# EAGLE schematic 60_FN (EAGLE 9.6.2)

## Sheet 1 of 2: Switch Matrix
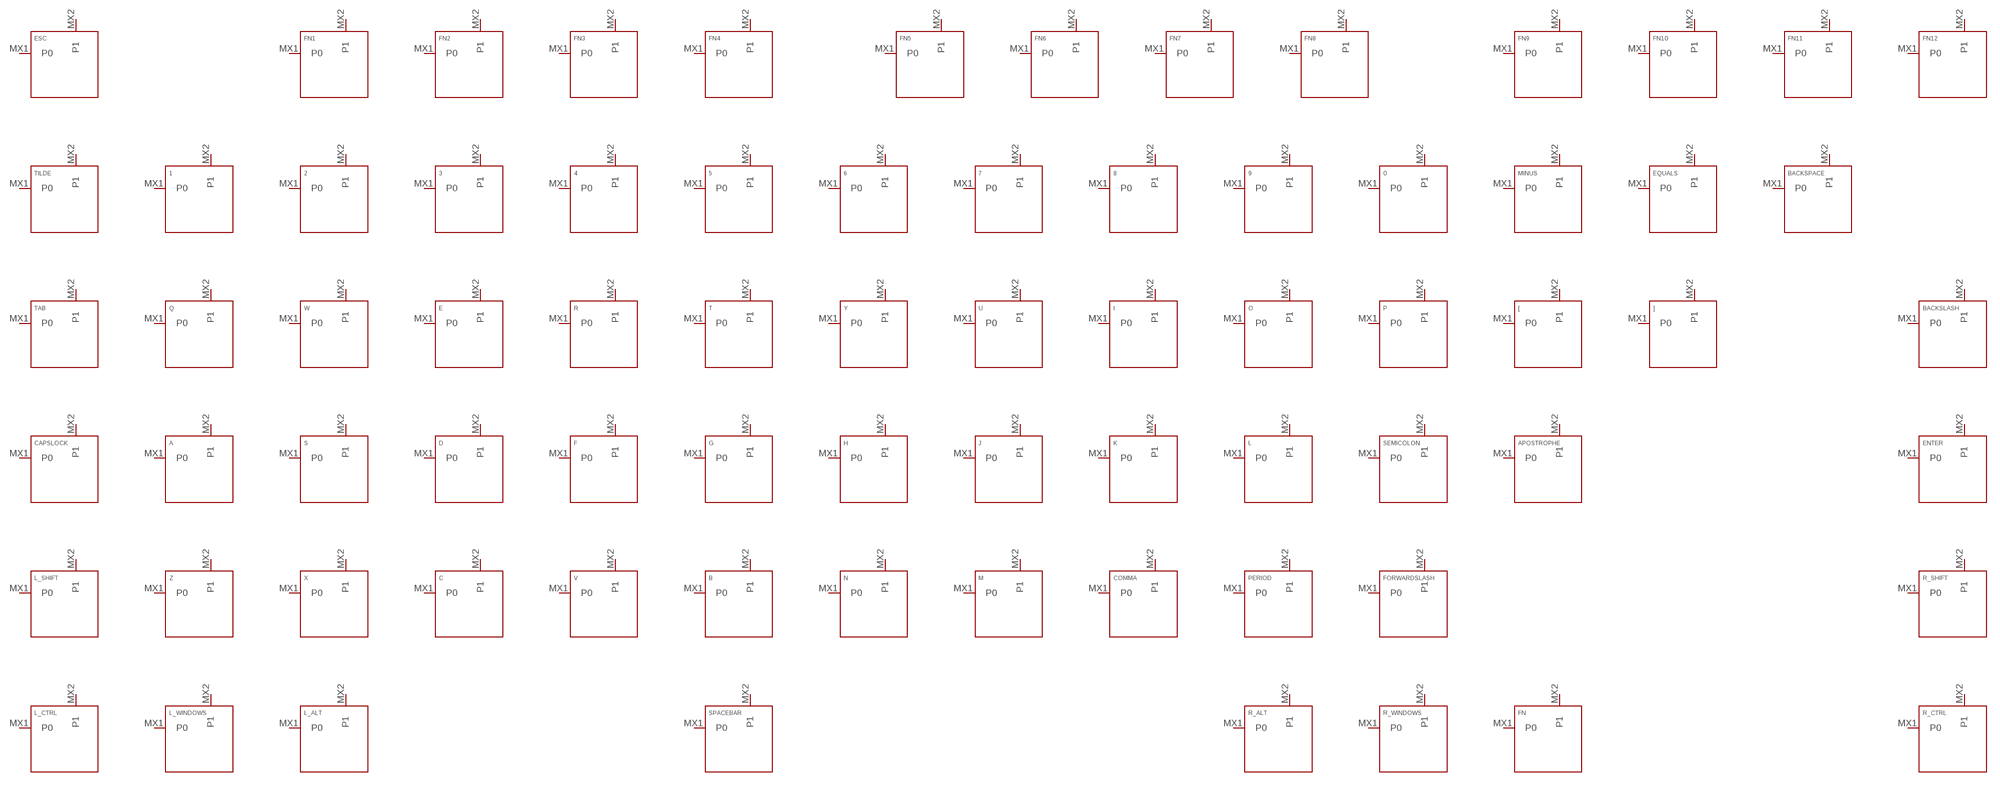
[diagram p0: schematic, sheet 1]

### Parts
0  KEYSWITCH-PLAIN-MX-1U  [MX-1U]
1  KEYSWITCH-PLAIN-MX-1U  [MX-1U]
2  KEYSWITCH-PLAIN-MX-1U  [MX-1U]
3  KEYSWITCH-PLAIN-MX-1U  [MX-1U]
4  KEYSWITCH-PLAIN-MX-1U  [MX-1U]
5  KEYSWITCH-PLAIN-MX-1U  [MX-1U]
6  KEYSWITCH-PLAIN-MX-1U  [MX-1U]
7  KEYSWITCH-PLAIN-MX-1U  [MX-1U]
8  KEYSWITCH-PLAIN-MX-1U  [MX-1U]
9  KEYSWITCH-PLAIN-MX-1U  [MX-1U]
[  KEYSWITCH-PLAIN-MX-1U  [MX-1U]
]  KEYSWITCH-PLAIN-MX-1U  [MX-1U]
A  KEYSWITCH-PLAIN-MX-1U  [MX-1U]
APOSTROPHE  KEYSWITCH-PLAIN-MX-1U  [MX-1U]
B  KEYSWITCH-PLAIN-MX-1U  [MX-1U]
BACKSLASH  KEYSWITCH-PLAIN-MX-1U  [MX-1U]
BACKSPACE  KEYSWITCH-PLAIN-MX-2U  [MX-2U]
C  KEYSWITCH-PLAIN-MX-1U  [MX-1U]
CAPSLOCK  KEYSWITCH-PLAIN-MX-1U  [MX-1U]
COMMA  KEYSWITCH-PLAIN-MX-1U  [MX-1U]
D  KEYSWITCH-PLAIN-MX-1U  [MX-1U]
E  KEYSWITCH-PLAIN-MX-1U  [MX-1U]
ENTER  KEYSWITCH-PLAIN-MX-2U  [MX-2U]
EQUALS  KEYSWITCH-PLAIN-MX-1U  [MX-1U]
ESC  KEYSWITCH-PLAIN-MX-1U  [MX-1U]
F  KEYSWITCH-PLAIN-MX-1U  [MX-1U]
FN  KEYSWITCH-PLAIN-MX-1U  [MX-1U]
FN1  KEYSWITCH-PLAIN-MX-1U  [MX-1U]
FN2  KEYSWITCH-PLAIN-MX-1U  [MX-1U]
FN3  KEYSWITCH-PLAIN-MX-1U  [MX-1U]
FN4  KEYSWITCH-PLAIN-MX-1U  [MX-1U]
FN5  KEYSWITCH-PLAIN-MX-1U  [MX-1U]
FN6  KEYSWITCH-PLAIN-MX-1U  [MX-1U]
FN7  KEYSWITCH-PLAIN-MX-1U  [MX-1U]
FN8  KEYSWITCH-PLAIN-MX-1U  [MX-1U]
FN9  KEYSWITCH-PLAIN-MX-1U  [MX-1U]
FN10  KEYSWITCH-PLAIN-MX-1U  [MX-1U]
FN11  KEYSWITCH-PLAIN-MX-1U  [MX-1U]
FN12  KEYSWITCH-PLAIN-MX-1U  [MX-1U]
FORWARDSLASH  KEYSWITCH-PLAIN-MX-1U  [MX-1U]
G  KEYSWITCH-PLAIN-MX-1U  [MX-1U]
H  KEYSWITCH-PLAIN-MX-1U  [MX-1U]
I  KEYSWITCH-PLAIN-MX-1U  [MX-1U]
J  KEYSWITCH-PLAIN-MX-1U  [MX-1U]
K  KEYSWITCH-PLAIN-MX-1U  [MX-1U]
L  KEYSWITCH-PLAIN-MX-1U  [MX-1U]
L_ALT  KEYSWITCH-PLAIN-MX-1U  [MX-1U]
L_CTRL  KEYSWITCH-PLAIN-MX-1U  [MX-1U]
L_SHIFT  KEYSWITCH-PLAIN-MX-2U  [MX-2U]
L_WINDOWS  KEYSWITCH-PLAIN-MX-1U  [MX-1U]
M  KEYSWITCH-PLAIN-MX-1U  [MX-1U]
MINUS  KEYSWITCH-PLAIN-MX-1U  [MX-1U]
N  KEYSWITCH-PLAIN-MX-1U  [MX-1U]
O  KEYSWITCH-PLAIN-MX-1U  [MX-1U]
P  KEYSWITCH-PLAIN-MX-1U  [MX-1U]
PERIOD  KEYSWITCH-PLAIN-MX-1U  [MX-1U]
Q  KEYSWITCH-PLAIN-MX-1U  [MX-1U]
R  KEYSWITCH-PLAIN-MX-1U  [MX-1U]
R_ALT  KEYSWITCH-PLAIN-MX-1U  [MX-1U]
R_CTRL  KEYSWITCH-PLAIN-MX-1U  [MX-1U]
R_SHIFT  KEYSWITCH-PLAIN-MX-2U  [MX-2U]
R_WINDOWS  KEYSWITCH-PLAIN-MX-1U  [MX-1U]
S  KEYSWITCH-PLAIN-MX-1U  [MX-1U]
SEMICOLON  KEYSWITCH-PLAIN-MX-1U  [MX-1U]
SPACEBAR  KEYSWITCH-PLAIN-MX-6.25U  [MX-6.25U]
T  KEYSWITCH-PLAIN-MX-1U  [MX-1U]
TAB  KEYSWITCH-PLAIN-MX-1U  [MX-1U]
TILDE  KEYSWITCH-PLAIN-MX-1U  [MX-1U]
U  KEYSWITCH-PLAIN-MX-1U  [MX-1U]
V  KEYSWITCH-PLAIN-MX-1U  [MX-1U]
W  KEYSWITCH-PLAIN-MX-1U  [MX-1U]
X  KEYSWITCH-PLAIN-MX-1U  [MX-1U]
Y  KEYSWITCH-PLAIN-MX-1U  [MX-1U]
Z  KEYSWITCH-PLAIN-MX-1U  [MX-1U]
Unconnected: 0.MX1(P0) 0.MX2(P1) 1.MX1(P0) 1.MX2(P1) 2.MX1(P0) 2.MX2(P1) 3.MX1(P0) 3.MX2(P1) 4.MX1(P0) 4.MX2(P1) 5.MX1(P0) 5.MX2(P1) 6.MX1(P0) 6.MX2(P1) 7.MX1(P0) 7.MX2(P1) 8.MX1(P0) 8.MX2(P1) 9.MX1(P0) 9.MX2(P1) [.MX1(P0) [.MX2(P1) ].MX1(P0) ].MX2(P1) A.MX1(P0) A.MX2(P1) APOSTROPHE.MX1(P0) APOSTROPHE.MX2(P1) B.MX1(P0) B.MX2(P1) BACKSLASH.MX1(P0) BACKSLASH.MX2(P1) BACKSPACE.MX1(P0) BACKSPACE.MX2(P1) C.MX1(P0) C.MX2(P1) CAPSLOCK.MX1(P0) CAPSLOCK.MX2(P1) COMMA.MX1(P0) COMMA.MX2(P1) D.MX1(P0) D.MX2(P1) E.MX1(P0) E.MX2(P1) ENTER.MX1(P0) ENTER.MX2(P1) EQUALS.MX1(P0) EQUALS.MX2(P1) ESC.MX1(P0) ESC.MX2(P1) F.MX1(P0) F.MX2(P1) FN1.MX1(P0) FN1.MX2(P1) FN2.MX1(P0) FN2.MX2(P1) FN3.MX1(P0) FN3.MX2(P1) FN4.MX1(P0) FN4.MX2(P1) FN5.MX1(P0) FN5.MX2(P1) FN6.MX1(P0) FN6.MX2(P1) FN7.MX1(P0) FN7.MX2(P1) FN8.MX1(P0) FN8.MX2(P1) FN9.MX1(P0) FN9.MX2(P1) FN10.MX1(P0) FN10.MX2(P1) FN11.MX1(P0) FN11.MX2(P1) FN12.MX1(P0) FN12.MX2(P1) FN.MX1(P0) FN.MX2(P1) FORWARDSLASH.MX1(P0) FORWARDSLASH.MX2(P1) G.MX1(P0) G.MX2(P1) H.MX1(P0) H.MX2(P1) I.MX1(P0) I.MX2(P1) J.MX1(P0) J.MX2(P1) K.MX1(P0) K.MX2(P1) L.MX1(P0) L.MX2(P1) L_ALT.MX1(P0) L_ALT.MX2(P1) L_CTRL.MX1(P0) L_CTRL.MX2(P1) L_SHIFT.MX1(P0) L_SHIFT.MX2(P1) L_WINDOWS.MX1(P0) L_WINDOWS.MX2(P1) M.MX1(P0) M.MX2(P1) MINUS.MX1(P0) MINUS.MX2(P1) N.MX1(P0) N.MX2(P1) O.MX1(P0) O.MX2(P1) P.MX1(P0) P.MX2(P1) PERIOD.MX1(P0) PERIOD.MX2(P1) Q.MX1(P0) Q.MX2(P1) R.MX1(P0) R.MX2(P1) R_ALT.MX1(P0) R_ALT.MX2(P1) R_CTRL.MX1(P0) R_CTRL.MX2(P1) R_SHIFT.MX1(P0) R_SHIFT.MX2(P1) R_WINDOWS.MX1(P0) R_WINDOWS.MX2(P1) S.MX1(P0) S.MX2(P1) SEMICOLON.MX1(P0) SEMICOLON.MX2(P1) SPACEBAR.MX1(P0) SPACEBAR.MX2(P1) T.MX1(P0) T.MX2(P1) TAB.MX1(P0) TAB.MX2(P1) TILDE.MX1(P0) TILDE.MX2(P1) U.MX1(P0) U.MX2(P1) V.MX1(P0) V.MX2(P1) W.MX1(P0) W.MX2(P1) X.MX1(P0) X.MX2(P1) Y.MX1(P0) Y.MX2(P1) Z.MX1(P0) Z.MX2(P1)

## Sheet 2 of 2
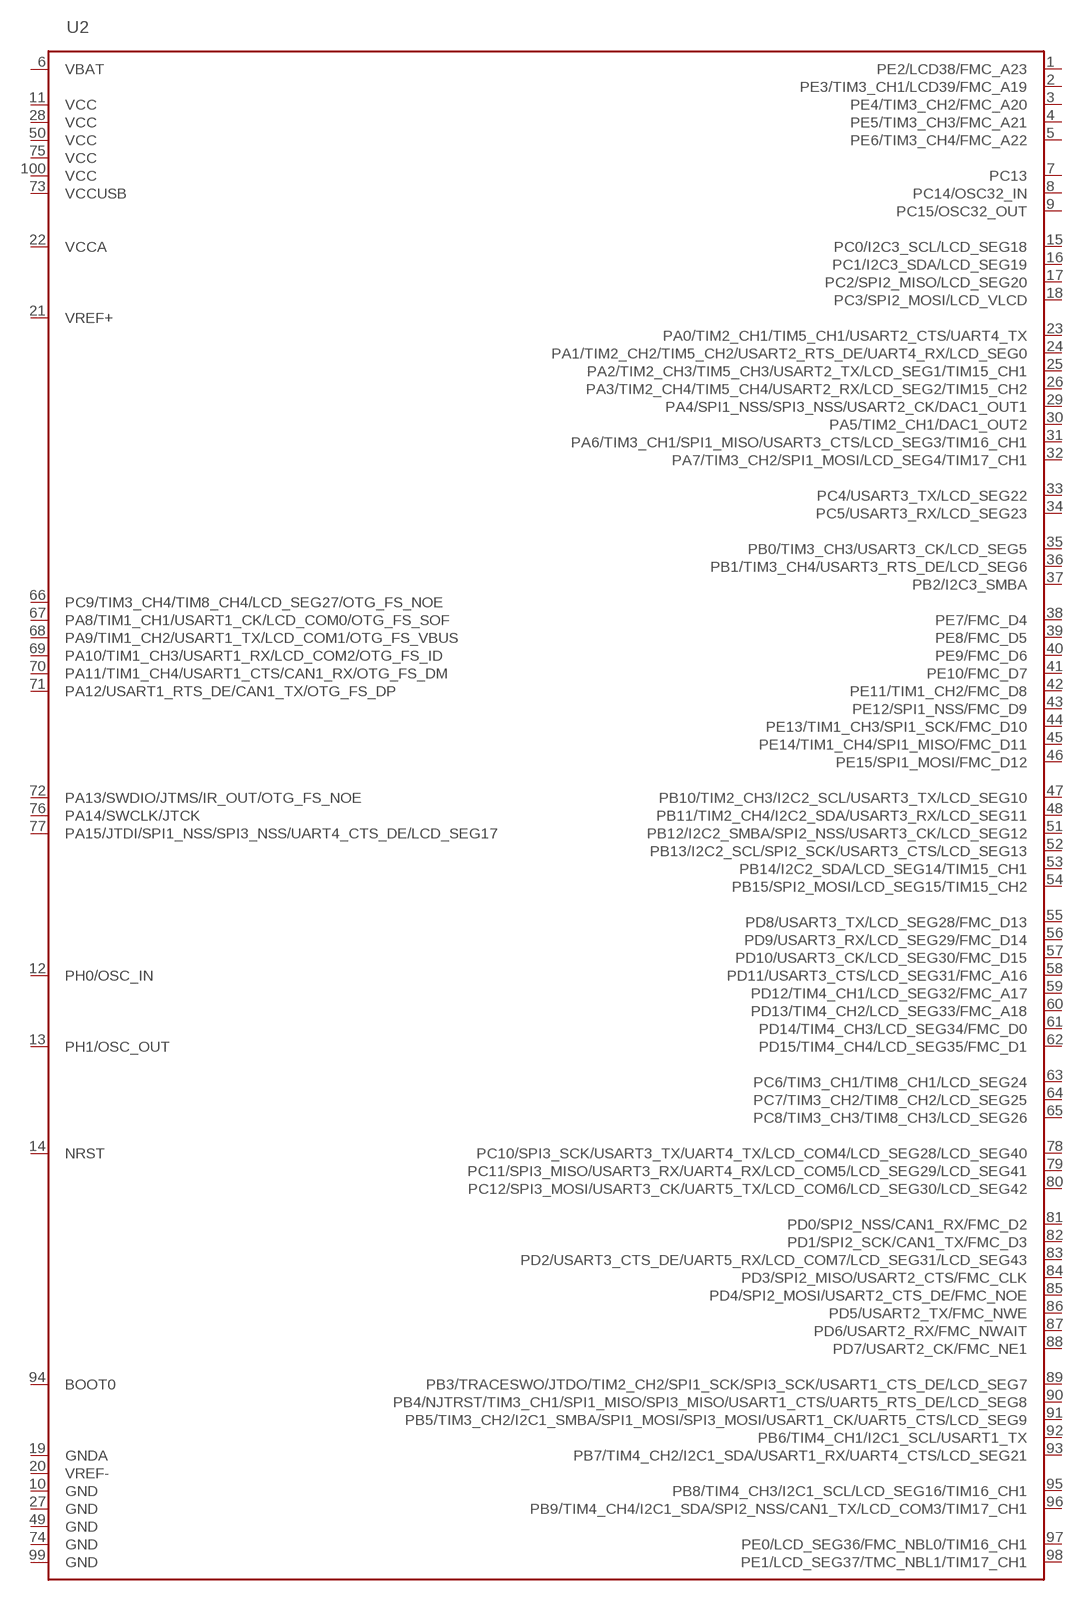
[diagram p1: schematic, sheet 2]

### Parts
U2  STM32L476V_T___  [LQFP100]
Unconnected: U2.1(PE2/LCD38/FMC_A23) U2.2(PE3/TIM3_CH1/LCD39/FMC_A19) U2.3(PE4/TIM3_CH2/FMC_A20) U2.4(PE5/TIM3_CH3/FMC_A21) U2.5(PE6/TIM3_CH4/FMC_A22) U2.6(VBAT) U2.7(PC13) U2.8(PC14/OSC32_IN) U2.9(PC15/OSC32_OUT) U2.10(GND) U2.11(VCC) U2.12(PH0/OSC_IN) U2.13(PH1/OSC_OUT) U2.14(NRST) U2.15(PC0/I2C3_SCL/LCD_SEG18) U2.16(PC1/I2C3_SDA/LCD_SEG19) U2.17(PC2/SPI2_MISO/LCD_SEG20) U2.18(PC3/SPI2_MOSI/LCD_VLCD) U2.19(GNDA) U2.20(VREF-) U2.21(VREF+) U2.22(VCCA) U2.23(PA0/TIM2_CH1/TIM5_CH1/USART2_CTS/UART4_TX) U2.24(PA1/TIM2_CH2/TIM5_CH2/USART2_RTS_DE/UART4_RX/LCD_SEG0) U2.25(PA2/TIM2_CH3/TIM5_CH3/USART2_TX/LCD_SEG1/TIM15_CH1) U2.26(PA3/TIM2_CH4/TIM5_CH4/USART2_RX/LCD_SEG2/TIM15_CH2) U2.27(GND) U2.28(VCC) U2.29(PA4/SPI1_NSS/SPI3_NSS/USART2_CK/DAC1_OUT1) U2.30(PA5/TIM2_CH1/DAC1_OUT2) U2.31(PA6/TIM3_CH1/SPI1_MISO/USART3_CTS/LCD_SEG3/TIM16_CH1) U2.32(PA7/TIM3_CH2/SPI1_MOSI/LCD_SEG4/TIM17_CH1) U2.33(PC4/USART3_TX/LCD_SEG22) U2.34(PC5/USART3_RX/LCD_SEG23) U2.35(PB0/TIM3_CH3/USART3_CK/LCD_SEG5) U2.36(PB1/TIM3_CH4/USART3_RTS_DE/LCD_SEG6) U2.37(PB2/I2C3_SMBA) U2.38(PE7/FMC_D4) U2.39(PE8/FMC_D5) U2.40(PE9/FMC_D6) U2.41(PE10/FMC_D7) U2.42(PE11/TIM1_CH2/FMC_D8) U2.43(PE12/SPI1_NSS/FMC_D9) U2.44(PE13/TIM1_CH3/SPI1_SCK/FMC_D10) U2.45(PE14/TIM1_CH4/SPI1_MISO/FMC_D11) U2.46(PE15/SPI1_MOSI/FMC_D12) U2.47(PB10/TIM2_CH3/I2C2_SCL/USART3_TX/LCD_SEG10) U2.48(PB11/TIM2_CH4/I2C2_SDA/USART3_RX/LCD_SEG11) U2.49(GND) U2.50(VCC) U2.51(PB12/I2C2_SMBA/SPI2_NSS/USART3_CK/LCD_SEG12) U2.52(PB13/I2C2_SCL/SPI2_SCK/USART3_CTS/LCD_SEG13) U2.53(PB14/I2C2_SDA/LCD_SEG14/TIM15_CH1) U2.54(PB15/SPI2_MOSI/LCD_SEG15/TIM15_CH2) U2.55(PD8/USART3_TX/LCD_SEG28/FMC_D13) U2.56(PD9/USART3_RX/LCD_SEG29/FMC_D14) U2.57(PD10/USART3_CK/LCD_SEG30/FMC_D15) U2.58(PD11/USART3_CTS/LCD_SEG31/FMC_A16) U2.59(PD12/TIM4_CH1/LCD_SEG32/FMC_A17) U2.60(PD13/TIM4_CH2/LCD_SEG33/FMC_A18) U2.61(PD14/TIM4_CH3/LCD_SEG34/FMC_D0) U2.62(PD15/TIM4_CH4/LCD_SEG35/FMC_D1) U2.63(PC6/TIM3_CH1/TIM8_CH1/LCD_SEG24) U2.64(PC7/TIM3_CH2/TIM8_CH2/LCD_SEG25) U2.65(PC8/TIM3_CH3/TIM8_CH3/LCD_SEG26) U2.66(PC9/TIM3_CH4/TIM8_CH4/LCD_SEG27/OTG_FS_NOE) U2.67(PA8/TIM1_CH1/USART1_CK/LCD_COM0/OTG_FS_SOF) U2.68(PA9/TIM1_CH2/USART1_TX/LCD_COM1/OTG_FS_VBUS) U2.69(PA10/TIM1_CH3/USART1_RX/LCD_COM2/OTG_FS_ID) U2.70(PA11/TIM1_CH4/USART1_CTS/CAN1_RX/OTG_FS_DM) U2.71(PA12/USART1_RTS_DE/CAN1_TX/OTG_FS_DP) U2.72(PA13/SWDIO/JTMS/IR_OUT/OTG_FS_NOE) U2.73(VCCUSB) U2.74(GND) U2.75(VCC) U2.76(PA14/SWCLK/JTCK) U2.77(PA15/JTDI/SPI1_NSS/SPI3_NSS/UART4_CTS_DE/LCD_SEG17) U2.78(PC10/SPI3_SCK/USART3_TX/UART4_TX/LCD_COM4/LCD_SEG28/LCD_SEG40) U2.79(PC11/SPI3_MISO/USART3_RX/UART4_RX/LCD_COM5/LCD_SEG29/LCD_SEG41) U2.80(PC12/SPI3_MOSI/USART3_CK/UART5_TX/LCD_COM6/LCD_SEG30/LCD_SEG42) U2.81(PD0/SPI2_NSS/CAN1_RX/FMC_D2) U2.82(PD1/SPI2_SCK/CAN1_TX/FMC_D3) U2.83(PD2/USART3_CTS_DE/UART5_RX/LCD_COM7/LCD_SEG31/LCD_SEG43) U2.84(PD3/SPI2_MISO/USART2_CTS/FMC_CLK) U2.85(PD4/SPI2_MOSI/USART2_CTS_DE/FMC_NOE) U2.86(PD5/USART2_TX/FMC_NWE) U2.87(PD6/USART2_RX/FMC_NWAIT) U2.88(PD7/USART2_CK/FMC_NE1) U2.89(PB3/TRACESWO/JTDO/TIM2_CH2/SPI1_SCK/SPI3_SCK/USART1_CTS_DE/LCD_SEG7) U2.90(PB4/NJTRST/TIM3_CH1/SPI1_MISO/SPI3_MISO/USART1_CTS/UART5_RTS_DE/LCD_SEG8) U2.91(PB5/TIM3_CH2/I2C1_SMBA/SPI1_MOSI/SPI3_MOSI/USART1_CK/UART5_CTS/LCD_SEG9) U2.92(PB6/TIM4_CH1/I2C1_SCL/USART1_TX) U2.93(PB7/TIM4_CH2/I2C1_SDA/USART1_RX/UART4_CTS/LCD_SEG21) U2.94(BOOT0) U2.95(PB8/TIM4_CH3/I2C1_SCL/LCD_SEG16/TIM16_CH1) U2.96(PB9/TIM4_CH4/I2C1_SDA/SPI2_NSS/CAN1_TX/LCD_COM3/TIM17_CH1) U2.97(PE0/LCD_SEG36/FMC_NBL0/TIM16_CH1) U2.98(PE1/LCD_SEG37/TMC_NBL1/TIM17_CH1) U2.99(GND) U2.100(VCC)

## Library data of the parts
0 1-9 [ ] A APOSTROPHE B BACKSLASH BACKSPACE C CAPSLOCK COMMA D E ENTER EQUALS ESC F FN FN1-FN12 FORWARDSLASH G H I J K L L_ALT L_CTRL L_SHIFT L_WINDOWS M MINUS N O P PERIOD Q R R_ALT R_CTRL R_SHIFT R_WINDOWS S SEMICOLON SPACEBAR T TAB TILDE U V W X Y Z = Keyboard:KEYSWITCH-PLAIN
U2 = MCU:STM32L476V_T___